# EAGLE design icom_interface (EAGLE 7.3.0)
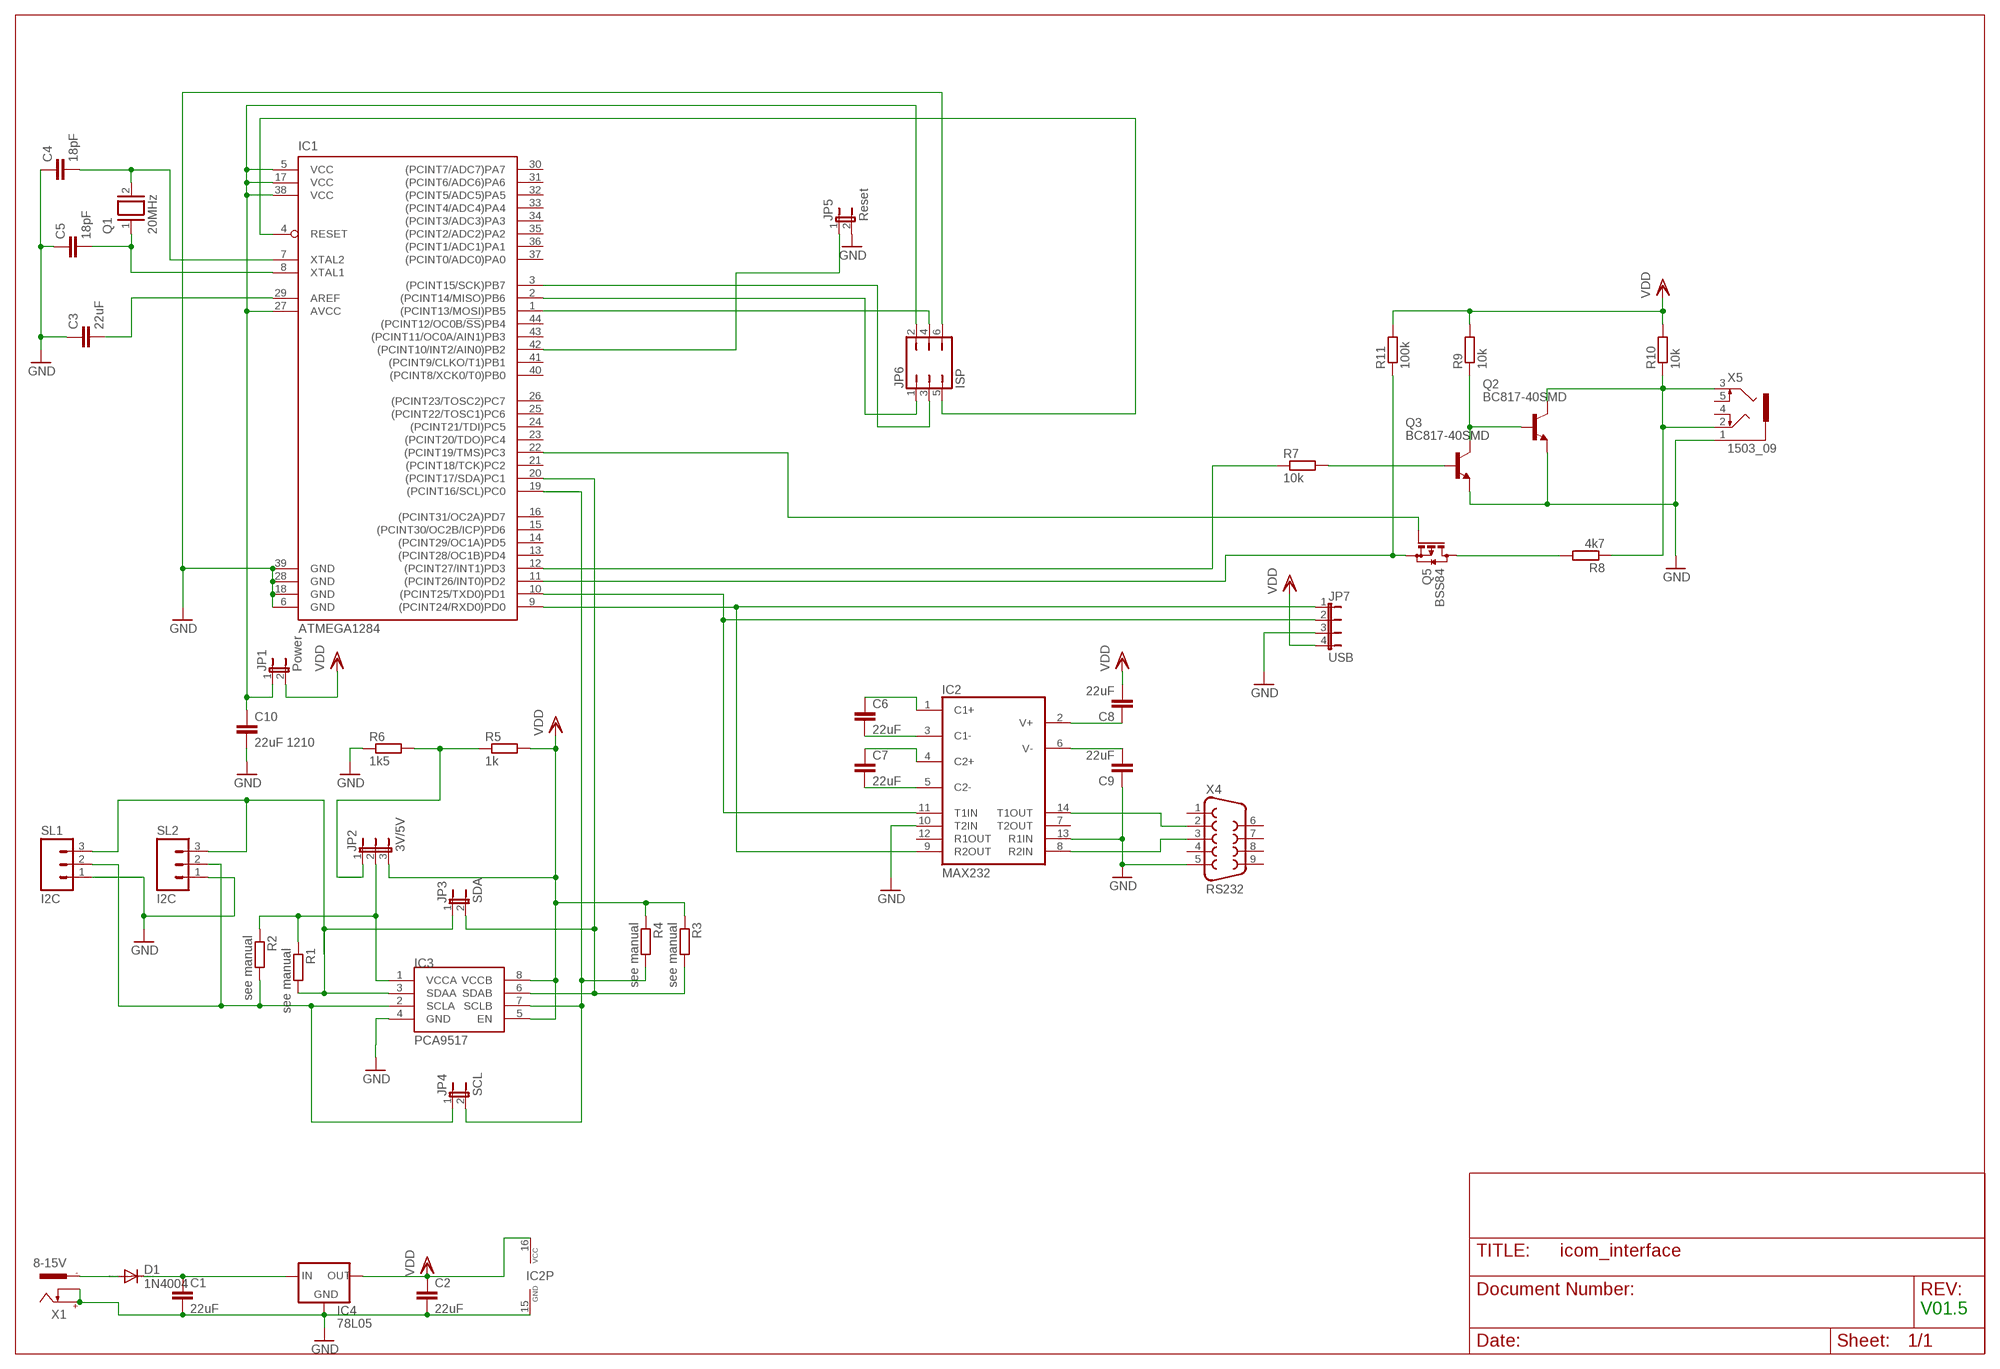
[diagram p0: schematic, sheet 1]

## Parts
C1  22uF  C-EUC1206  [C1206]
C2  22uF  C-EUC1206  [C1206]
C3  22uF  C-EUC1206  [C1206]
C4  18pF  C-EU025-025X050  [C025-025X050]
C5  18pF  C-EU025-025X050  [C025-025X050]
C6  22uF  C-EUC1206  [C1206]
C7  22uF  C-EUC1206  [C1206]
C8  22uF  C-EUC1206  [C1206]
C9  22uF  C-EUC1206  [C1206]
C10  22uF 1210  C-EUC1206  [C1206]
D1  1N4004  [DO41-10]
IC1  ATMEGA1284  ATMEGA644A  [TQFP44]
IC2  MAX232  [DIL16]
IC3  PCA9517  [SO-08]
IC4  78L05  78LXX  [78LXX]
JP1  Power  JP1E  [JP1]
JP2  3V/5V  JP2E  [JP2]
JP3  SDA  JP1E  [JP1]
JP4  SCL  JP1E  [JP1]
JP5  Reset  JP1E  [JP1]
JP6  ISP  JP3Q  [JP3Q]
JP7  USB  JP4E  [JP4]
Q1  20MHz  XTAL/S  [QS]
Q2  BC817-40SMD  [SOT23-BEC]
Q3  BC817-40SMD  [SOT23-BEC]
Q5  BSS84  [SOT23]
R1  see manual  R-EU_R1206  [R1206]
R2  see manual  R-EU_R1206  [R1206]
R3  see manual  R-EU_R1206  [R1206]
R4  see manual  R-EU_R1206  [R1206]
R5  1k  R-EU_R1206  [R1206]
R6  1k5  R-EU_R1206  [R1206]
R7  10k  R-EU_R1206  [R1206]
R8  4k7  R-EU_R1206  [R1206]
R9  10k  R-EU_R1206  [R1206]
R10  10k  R-EU_R1206  [R1206]
R11  100k  R-EU_R1206  [R1206]
SL1  I2C  M03  [03P]
SL2  I2C  M03  [03P]
X1  8-15V  737992-55  [737992-5]
X4  RS232  F09H  [F09H]
X5  1503_09  [1503_09]

## Nets
C13: C6.1 IC2.1(C1+)
GND: C1.2 C2.2 C3.1 C4.1 C5.1 C9.1 C10.2 IC1.6(GND) IC1.18(GND) IC1.28(GND) IC1.39(GND) IC2.10(T2IN) IC2.13(R1IN) IC2.15(GND) IC3.4(GND) IC4.GND JP5.2 JP6.6 JP7.3 Q2.E Q3.E R6.1 SL1.1 SL2.1 X1.+ X1.K X4.5 X5.1
N$1: Q3.B R7.2
N$2: IC1.9((PCINT24/RXD0)PD0) IC2.9(R2OUT) JP7.1
N$3: C7.2 IC2.5(C2-)
N$5: IC1.20((PCINT17/SDA)PC1) IC3.6(SDAB) JP3.2 R3.2
N$6: IC1.2((PCINT14/MISO)PB6) JP6.1
N$7: C10.1 IC1.5(VCC) IC1.17(VCC) IC1.27(AVCC) IC1.38(VCC) JP1.1 JP6.2
N$8: C4.2 IC1.7(XTAL2) Q1.2
N$9: Q2.C R8.1 R10.1 X5.2 X5.3
N$10: IC2.14(T1OUT) X4.2
N$11: IC1.12((PCINT27/INT1)PD3) R7.1
N$12: IC1.10((PCINT25/TXD0)PD1) IC2.11(T1IN) JP7.2
N$13: C7.1 IC2.4(C2+)
N$14: C6.2 IC2.3(C1-)
N$15: IC1.42((PCINT10/INT2/AIN0)PB2) JP5.1
N$16: C8.1 IC2.2(V+)
N$17: C9.2 IC2.6(V-)
N$18: IC1.4(RESET) JP6.5
N$19: IC1.11((PCINT26/INT0)PD2) Q5.2(S) R11.1
N$20: IC1.3((PCINT15/SCK)PB7) JP6.3
N$21: C5.2 IC1.8(XTAL1) Q1.1
N$22: IC1.19((PCINT16/SCL)PC0) IC3.7(SCLB) JP4.2 R4.2
N$23: IC3.3(SDAA) JP3.1 R1.2 SL1.3 SL2.3
N$24: C3.2 IC1.29(AREF)
N$25: IC3.2(SCLA) JP4.1 R2.2 SL1.2 SL2.2
N$26: JP2.1 R5.1 R6.2
N$27: D1.A X1.-1
N$28: IC1.1((PCINT13/MOSI)PB5) JP6.4
N$29: Q5.3(D) R8.2
N$30: Q2.B Q3.C R9.1
N$32: IC3.1(VCCA) JP2.2 R1.1 R2.1
N$33: C1.1 D1.C IC4.IN
N$34: IC1.22((PCINT19/TMS)PC3) Q5.1(G)
N$41: IC2.8(R2IN) X4.3
VDD: C2.1 C8.2 IC2.16(VCC) IC3.5(EN) IC3.8(VCCB) IC4.OUT JP1.2 JP2.3 JP7.4 R3.1 R4.1 R5.2 R9.2 R10.2 R11.2
Unconnected: IC1.13((PCINT28/OC1B)PD4) IC1.14((PCINT29/OC1A)PD5) IC1.15((PCINT30/OC2B/ICP)PD6) IC1.16((PCINT31/OC2A)PD7) IC1.21((PCINT18/TCK)PC2) IC1.23((PCINT20/TDO)PC4) IC1.24((PCINT21/TDI)PC5) IC1.25((PCINT22/TOSC1)PC6) IC1.26((PCINT23/TOSC2)PC7) IC1.30((PCINT7/ADC7)PA7) IC1.31((PCINT6/ADC6)PA6) IC1.32((PCINT5/ADC5)PA5) IC1.33((PCINT4/ADC4)PA4) IC1.34((PCINT3/ADC3)PA3) IC1.35((PCINT2/ADC2)PA2) IC1.36((PCINT1/ADC1)PA1) IC1.37((PCINT0/ADC0)PA0) IC1.40((PCINT8/XCK0/T0)PB0) IC1.41((PCINT9/CLKO/T1)PB1) IC1.43((PCINT11/OC0A/AIN1)PB3) IC1.44((PCINT12/OC0B/!SS!)PB4) IC2.7(T2OUT) IC2.12(R1OUT) X1.-2 X4.1 X4.4 X4.6 X4.7 X4.8 X4.9 X5.4 X5.5

## Notes on the sheet
- V01.5

## Library data of the parts
C1-C3 C6-C10 = rcl:C-EU: CAPACITOR, European symbol
C4 C5 = resistor:C-EU: CAPACITOR, European symbol
D1 = diode:1N4004: DIODE general purpose rectifier, 1 A
IC1 = atmel:ATMEGA644: 8-bit Microcontroller with 64K Bytes In-System Programmable Flash Source: http://www.atmel.com/dyn/resources/prod_documents/doc2593.pdf; MPN: ATMEGA644PV-10AU; OC_FARNELL: 1455123; OC_NEWARK: 58M3748
IC2 = maxim:MAX232: RS232 TRANSCEIVER; MF: MAXIM; MPN: MAX232ACPE+; OC_FARNELL: 9723773; OC_NEWARK: 68K4544
IC3 = PCA9517:PCA9517: PCA9517
IC4 = v-reg:78LXX: VOLTAGE REGULATOR
JP1 JP3-JP5 = jumper:JP1E: JUMPER
JP2 = jumper:JP2E: JUMPER
JP6 = jumper:JP3Q: JUMPER
JP7 = jumper:JP4E: JUMPER
Q1 = special:XTAL/S: CRYSTAL
Q2 Q3 = transistor-npn:BC817*: NPN Transistor
Q5 = transistor-small-signal:BSS84: P-CHANNEL MOS FET
R1-R11 = resistor:R-EU_: RESISTOR, European symbol
SL1 SL2 = con-amp-quick:M03: AMP QUICK CONNECTOR; OC_FARNELL: unknown; OC_NEWARK: unknown
X1 = con-conrad:737992-55: FEMALE PRINT CONNECTOR DIN 45323 (34V/3A), ROKA, distributor Conrad
X4 = con-subd:F09: SUB-D; OC_FARNELL: unknown; OC_NEWARK: unknown
X5 = con-lumberg:1503_09: Jack connectors according to JISC 6560, 3.5 mm Klinkeneinbaukupplung nach JISC 6560, 3,5 mm, 3-polig/ stereo, abgewinkelte Ausführung, mit 2 Öffnern und Lötaugen, für Leiterplatten Rückseitenmontage Source: http://www.lumberg.com/Produkte/PDFs/1503_09.pdf; OC_FARNELL: 1243244; OC_NEWARK: unknown

## Board
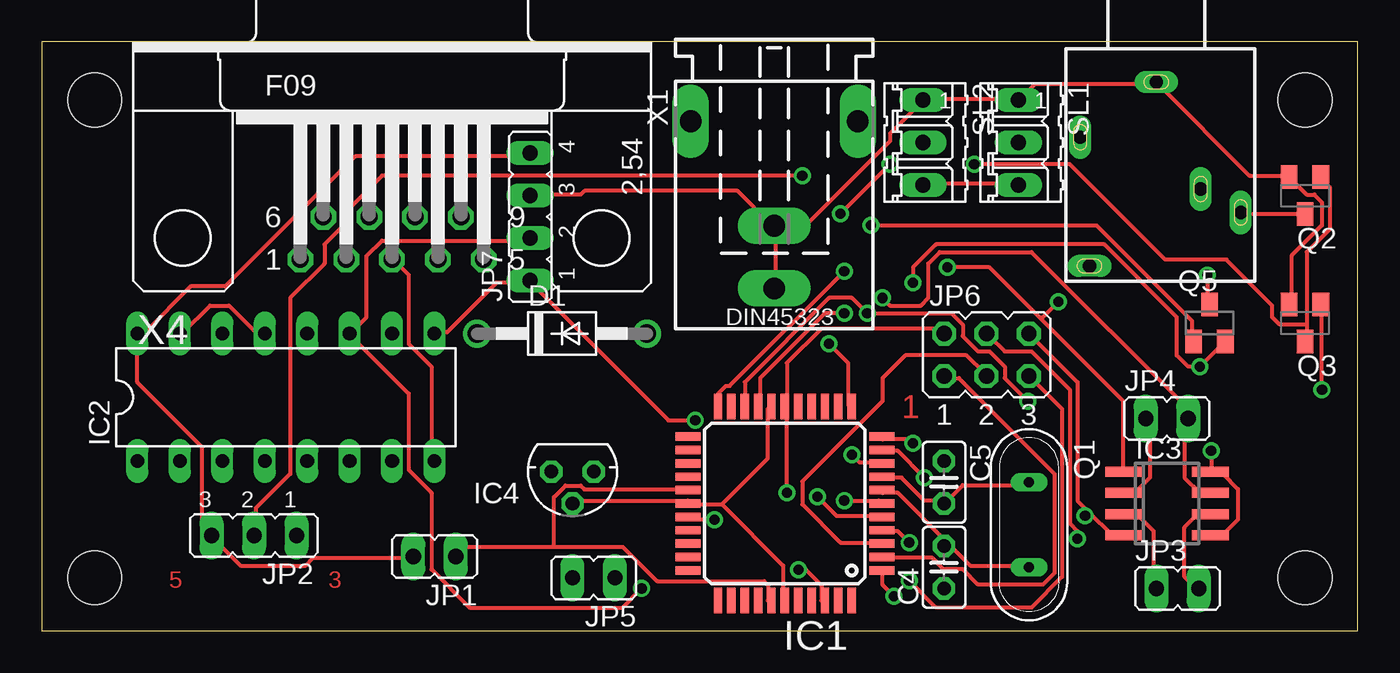
[diagram p1: board, top side]
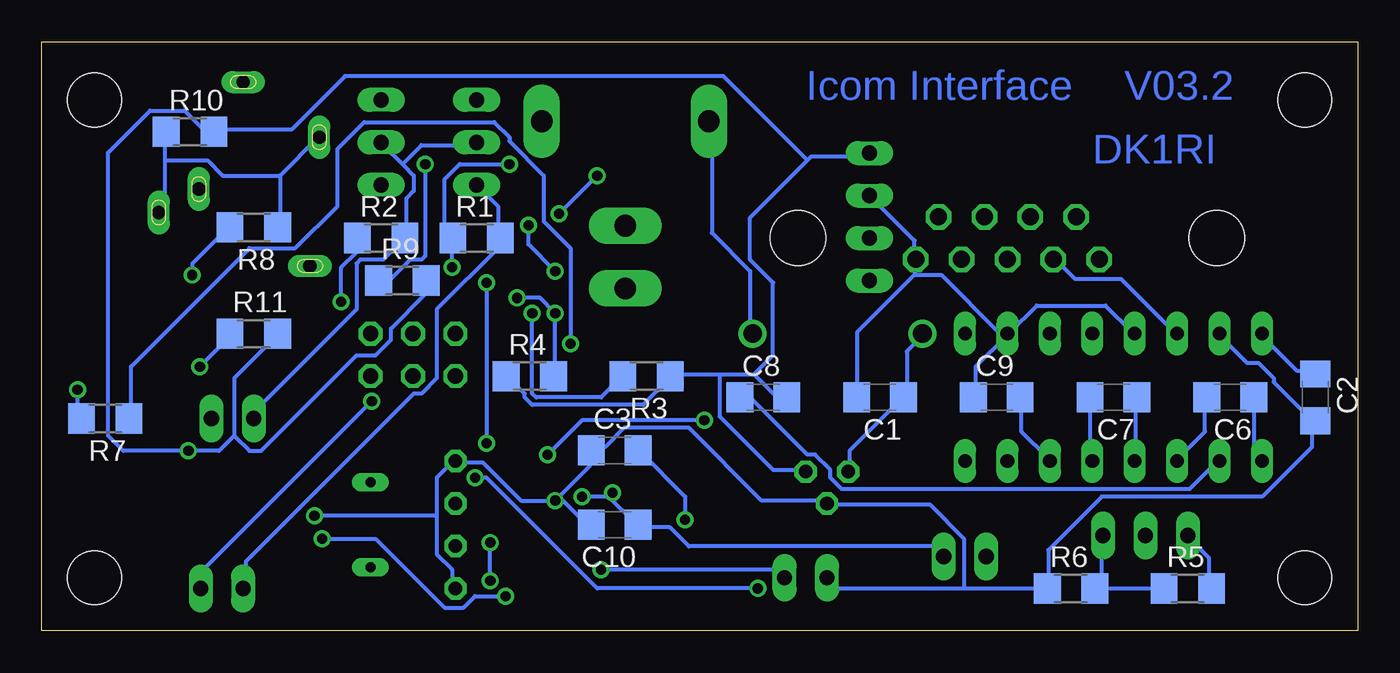
[diagram p2: board, bottom side, seen from below]

Size 78.72 x 35.23 mm. Coordinates in mm from the lower left corner, seen from the top.
Outline: 0,0 78.72,0 78.72,35.23 0,35.23 0,0
Copper layers (1*16): Top 0.035mm / dielectric 1.5mm / Bottom 0.035mm
Design rules "default": minimum track width 10mil, minimum drill 24mil, track to track 8mil, track to pad 8mil, pad to pad 8mil, via to via 8mil, smd to smd 8mil, copper to edge 40mil, drill to drill 8mil, minimum pad ring 10mil, minimum via ring 8mil, stop-mask expansion 4mil, vias tented up to drill 0mil, thermal gap 10mil
Holes 3.2 mm at 75.56,31.75 75.56,3.17 3.17,3.17 3.17,31.75

### Footprints (pad centres in the part's own frame; a part is rotated, then mirrored left to right if it is on the bottom)
C1206 = smd 1.6 x 1.8: 1 -1.4,0; 2 1.4,0
C025-025X050 = drill 0.813 octagon: 1 -1.27,0; 2 1.27,0
DO41-10 = drill 1.118: A 5.08,0; C -5.08,0
TQFP44 = smd 1.5 x 0.5: 1 -5.8,4; 2 -5.8,3.2; 3 -5.8,2.4; 4 -5.8,1.6; 5 -5.8,0.8; 6 -5.8,0; 7 -5.8,-0.8; 8 -5.8,-1.6; 9 -5.8,-2.4; 10 -5.8,-3.2; 11 -5.8,-4; 23 5.8,-4; 24 5.8,-3.2; 25 5.8,-2.4; 26 5.8,-1.6; 27 5.8,-0.8; 28 5.8,0; 29 5.8,0.8; 30 5.8,1.6; 31 5.8,2.4; 32 5.8,3.2; 33 5.8,4 | smd 0.5 x 1.5: 12 -4,-5.8; 13 -3.2,-5.8; 14 -2.4,-5.8; 15 -1.6,-5.8; 16 -0.8,-5.8; 17 0,-5.8; 18 0.8,-5.8; 19 1.6,-5.8; 20 2.4,-5.8; 21 3.2,-5.8; 22 4,-5.8; 34 4,5.8; 35 3.2,5.8; 36 2.4,5.8; 37 1.6,5.8; 38 0.8,5.8; 39 0,5.8; 40 -0.8,5.8; 41 -1.6,5.8; 42 -2.4,5.8; 43 -3.2,5.8; 44 -4,5.8
DIL16 = drill 0.813 long: 1 -8.89,-3.81; 2 -6.35,-3.81; 3 -3.81,-3.81; 4 -1.27,-3.81; 5 1.27,-3.81; 6 3.81,-3.81; 7 6.35,-3.81; 8 8.89,-3.81; 9 8.89,3.81; 10 6.35,3.81; 11 3.81,3.81; 12 1.27,3.81; 13 -1.27,3.81; 14 -3.81,3.81; 15 -6.35,3.81; 16 -8.89,3.81
SO-08 = smd 0.6 x 2.2: 1 -1.905,-2.6; 2 -0.635,-2.6; 3 0.635,-2.6; 4 1.905,-2.6; 5 1.905,2.6; 6 0.635,2.6; 7 -0.635,2.6; 8 -1.905,2.6
78LXX = drill 0.813 octagon: GND 0,1.905; IN 1.27,0; OUT -1.27,0
JP1 = drill 0.914 long: 1 0,-1.27; 2 0,1.27
JP2 = drill 0.914 long: 1 -2.54,0; 2 0,0; 3 2.54,0
JP3Q = drill 0.914 octagon: 1 -2.54,-1.27; 2 -2.54,1.27; 3 0,-1.27; 4 0,1.27; 5 2.54,-1.27; 6 2.54,1.27
JP4 = drill 0.914 long: 1 -3.81,0; 2 -1.27,0; 3 1.27,0; 4 3.81,0
QS = drill 0.61 long: 1 -2.54,0; 2 2.54,0
SOT23-BEC = smd 1 x 1.4: B -0.95,-1.1; C 0,1.1; E 0.95,-1.1
SOT23 = smd 1 x 1.4: 1 -0.95,-1.1; 2 0.95,-1.1; 3 0,1.1
R1206 = smd 1.6 x 1.803: 1 -1.422,0; 2 1.422,0
03P = drill 0.914 long: 1 -2.54,0; 2 0,0; 3 2.54,0
737992-5 = drill 1.3 pad 2.184 long: + 0,10; -1 5,0; -2 -5,0; K 0,6.25
F09H = drill 1.016 octagon: 1 -5.486,-1.27; 2 -2.743,-1.27; 3 0,-1.27; 4 2.743,-1.27; 5 5.486,-1.27; 6 -4.115,1.27; 7 -1.372,1.27; 8 1.372,1.27; 9 4.115,1.27 | hole 3.302: -12.522,0; 12.522,0
1503_09 = drill 0.8 pad 1.2 long: 1 0,-2.1; 2 -4.55,-5.4; 3 5.05,-9.9; 4 -4,-13.1; 5 2.65,-8.5

### Placement (x,y rotation side)
C1  28.57,13.97 180 bottom
C2  2.54,13.97 270 bottom
C3  44.45,10.79 0 bottom
C4  53.98,3.81 90 top
C5  53.98,8.89 270 top
C6  7.62,13.97 180 bottom
C7  14.61,13.97 180 bottom
C8  35.56,13.97 0 bottom
C9  21.59,13.97 0 bottom
C10  44.45,6.35 180 bottom
D1  31.11,17.78 0 top
IC1  44.45,7.62 180 top
IC2  14.61,13.97 0 top
IC3  67.31,7.62 270 top
IC4  31.75,9.53 180 top
JP1  23.5,4.45 90 top
JP2  12.7,5.71 180 top
JP3  67.94,2.54 270 top
JP4  67.31,12.7 270 top
JP5  33.02,3.17 90 top
JP6  56.52,16.51 0 top
JP7  29.21,24.77 90 top
Q1  59.05,6.35 270 top
Q2  75.56,26.04 180 top
Q3  75.56,18.41 180 top
Q5  69.85,18.41 0 top
R1  52.7,23.5 0 bottom
R2  58.42,23.5 0 bottom
R3  42.55,15.24 180 bottom
R4  49.53,15.24 0 bottom
R5  10.16,2.54 0 bottom
R6  17.14,2.54 0 bottom
R7  74.93,12.7 180 bottom
R8  66.04,24.13 180 bottom
R9  57.15,20.95 0 bottom
R10  69.85,29.84 0 bottom
R11  66.04,17.78 0 bottom
SL1  58.42,29.21 270 top
SL2  52.7,29.21 270 top
X1  43.81,30.48 180 top
X4  20.95,23.5 0 top
X5  66.67,34.92 0 top

### Tracks (layer width: path | path; a pad name or v marks a point on that pad's centre or on a via)
C13
  Bottom 0.254: C6.1 6.17,13.97 6.17,10.77 5.71,10.31 IC2.1
GND  (via drill 0.61)
  Top 0.254: 62.64,7.11 61.95,7.8 61.95,14.88 JP6.6 | 62.64,7.11 64.01,5.74 64.69,5.74 IC3.4 | v48.01,7.8 50.06,7.8 IC1.6 | IC4.GND 31.77,7.8 38.63,7.8 IC1.28 38.86,7.57 40.69,7.57 | 40.69,7.57 44.35,3.91 44.35,1.85 IC1.39 | 40.69,7.57 43.43,10.31 43.43,13.28 IC1.18 | v62.41,6.88 62.64,7.11 | IC2.13 13.26,17.86 12.8,17.86 11.2,19.46 10.06,19.46 8.46,17.86 IC2.15 | X1.+ 43.89,20.6 43.89,24.03 X1.K | Q3.E 74.75,19.68 74.75,22.43 76.58,24.26 76.58,25.63 76.12,26.09 75.67,26.09 74.75,27 Q2.E 74.52,27.23 72.24,27.23 66.75,32.72 X5.1 66.52,32.72 59.44,32.72 58.52,31.8 SL1.1 58.29,31.8 52.81,31.8 SL2.1 52.58,31.57 50.75,29.74 50.75,29.29 45.72,24.26 43.89,24.26 X1.K | JP7.3 29.26,26.09 32.23,26.09 32.46,26.31 41.6,26.31 43.66,24.26 X1.K
  Bottom 0.254: v48.01,7.8 47.55,7.8 45.95,6.2 C10.2 | v48.01,7.8 45.95,9.86 45.95,10.77 C3.1 45.72,11 45.03,11 43.89,12.14 40.01,12.14 35.66,7.8 31.77,7.8 IC4.GND 31.55,7.57 25.6,7.57 23.55,5.51 23.55,2.54 | 55.09,6.88 55.09,9.17 54.18,10.08 C5.1 53.95,10.08 52.35,10.08 50.06,7.8 v48.01,7.8 | 55.09,6.88 55.09,4.6 54.18,3.68 54.18,2.54 C4.1 | 23.55,2.54 31.09,2.54 31.55,3 JP5.2 | 23.55,2.54 R6.1 18.52,2.54 18.52,4.83 15.32,8.03 5.71,8.03 2.74,11 2.74,12.37 C2.2 2.74,12.6 5.03,14.88 5.03,15.11 5.94,16.03 6.63,16.03 8.23,17.63 IC2.15 | 55.09,6.88 v62.41,6.88 | C9.1 22.86,13.97 22.86,15.8 21.03,17.63 IC2.10 | 26.52,21.29 29.95,17.86 29.95,13.97 C1.2 | 26.52,21.29 26.52,22.2 X4.5 26.52,22.43 26.52,23.34 JP7.3 | 26.52,21.29 24.92,21.29 21.49,17.86 21.03,17.86 IC2.10 | IC2.13 13.49,17.86 15.09,19.46 19.2,19.46 20.8,17.86 IC2.10
N$1  (via drill 0.61)
  Top 0.254: v76.58,14.43 76.58,19.46 Q3.B
  Bottom 0.254: v76.58,14.43 76.58,13.06 76.35,12.83 R7.2
N$2  (via drill 0.61)
  Top 0.254: v48.46,10.54 48.92,10.08 50.06,10.08 IC1.9 | v39.09,12.6 37.49,12.6 29.26,20.83 JP7.1 29.03,20.83 27.2,20.83 24.23,17.86 23.55,17.86 IC2.9
  Bottom 0.254: v48.46,10.54 46.41,12.6 v39.09,12.6
N$3
  Bottom 0.254: C7.2 16,10.31 IC2.5
N$5  (via drill 0.61)
  Top 0.254: IC3.6 69.72,6.88 69.04,6.88 68.35,6.2 68.35,3.23 69.04,2.54 JP3.2 | IC1.20 42.06,13.51 42.06,14.88 47.09,19.91 48.46,19.91 v49.38,19 54.41,19 55.09,18.31 55.09,17.63 56.01,16.71 56.69,16.71 57.61,15.8 57.61,15.11 v58.98,13.74
  Bottom 0.254: v49.38,19 49.38,14.2 49.15,13.97 45.26,13.97 44.12,15.11 R3.2 | v58.98,13.74 69.04,3.68 69.04,2.54 JP3.2
N$6
  Top 0.254: IC1.2 50.29,4.37 53.26,4.37 53.95,3.68 55.09,3.68 56.01,2.77 59.89,2.77 60.58,3.45 60.58,9.4 54.86,15.11 54.18,15.11 JP6.1
N$7  (via drill 0.61)
  Top 0.254: JP6.2 53.95,17.86 53.72,18.09 46.63,18.09 44.58,16.03 44.58,13.51 IC1.17 44.58,13.28 v44.58,8.26 | v46.41,8.03 47.55,6.88 50.06,6.88 IC1.5 | 30.63,5.03 25.38,5.03 24.92,4.57 JP1.1 | 30.63,5.03 34.75,5.03 36.8,2.97 43.2,2.97 43.43,2.74 43.43,1.83 IC1.38 | 30.63,5.03 30.63,8 31.32,8.69 32.23,8.69 32.46,8.46 38.63,8.46 IC1.27
  Bottom 0.254: 44.81,8.03 v46.41,8.03 | 44.81,8.03 43.2,6.43 C10.1 42.98,6.2 41.15,6.2 40.01,5.05 25.38,5.05 JP1.1 | 44.81,8.03 v44.58,8.26
N$8
  Top 0.254: 54.18,5.28 51.21,8.26 50.29,8.26 IC1.7 | 54.18,5.28 55.55,3.91 58.98,3.91 Q1.2 | 54.18,5.28 C4.2
N$9
  Top 0.254: Q2.C 75.44,24.94 71.78,24.94 X5.3
  Bottom 0.254: 64.47,27.23 64.47,24.26 R8.1 | 64.47,27.23 62.18,29.52 X5.2 | 71.32,28.14 71.32,25.4 71.55,25.17 X5.3 | 71.32,28.14 71.32,29.74 R10.1 | 64.47,27.23 67.89,27.23 68.81,28.14 71.32,28.14
N$10
  Bottom 0.254: IC2.14 10.97,17.86 14.17,21.06 16.92,21.06 18.06,22.2 X4.2
N$11  (via drill 0.61)
  Top 0.254: v47.09,17.17 48.23,16.03 48.23,13.51 IC1.12
  Bottom 0.254: v47.09,17.17 47.09,22.89 48.69,24.49 48.69,27.23 50.75,29.29 50.75,29.52 51.66,30.43 59.44,30.43 61.04,28.83 61.04,25.4 63.55,22.89 66.29,22.89 73.38,15.8 73.38,12.83 R7.1
N$12  (via drill 0.61)
  Top 0.254: v52.81,9.17 51.21,10.77 50.29,10.77 IC1.10 | v35.89,2.54 34.75,1.4 25.6,1.4 23.32,3.68 23.32,8.26 21.95,9.63 21.95,14.2 18.52,17.63 IC2.11 18.52,17.86 19.43,18.77 19.43,22.43 20.34,23.34 29.03,23.34 JP7.2
  Bottom 0.254: v52.81,9.17 52.12,9.17 45.49,2.54 v35.89,2.54
N$13
  Bottom 0.254: C7.1 13.26,13.97 13.26,10.31 IC2.4
N$14
  Bottom 0.254: C6.2 9.14,13.97 9.14,11.91 10.74,10.31 IC2.3
N$15  (via drill 0.61)
  Top 0.254: v45.26,3.66 45.72,3.66 46.63,2.74 46.63,1.83 IC1.42
  Bottom 0.254: v45.26,3.66 34.75,3.66 34.29,3.2 JP5.1
N$16
  Bottom 0.254: C8.1 36.35,13.97 32.92,10.54 32.46,10.54 31.55,9.63 31.55,9.17 30.86,8.48 10.06,8.48 8.46,10.08 IC2.2
N$17
  Bottom 0.254: C9.2 20.12,13.97 20.12,11.91 18.52,10.31 IC2.6
N$18  (via drill 0.61)
  Top 0.254: v51.89,5.28 51.21,5.97 50.29,5.97 IC1.4 | v51.89,3 53.49,1.4 59.21,1.4 61.04,3.23 61.04,13.28 59.21,15.11 JP6.5
  Bottom 0.254: v51.89,3 v51.89,5.28
N$19  (via drill 0.61)
  Top 0.254: Q5.2 70.64,17.17 v69.27,15.8 68.58,15.8 67.89,16.48 67.89,18.77 63.55,23.11 53.49,23.11 52.12,21.74 v52.12,20.83 | v52.12,11.23 51.89,11.46 50.29,11.46 IC1.11
  Bottom 0.254: v69.27,15.8 67.44,17.63 R11.1 | v52.12,20.83 v52.12,11.23
N$20
  Top 0.254: IC1.3 50.06,5.28 47.78,5.28 45.49,7.57 45.49,8.94 50.29,13.74 50.29,15.11 51.66,16.48 55.32,16.48 56.46,15.34 JP6.3
N$21
  Top 0.254: IC1.8 50.29,9.17 51.44,9.17 52.81,7.8 53.95,7.8 C5.2 54.18,7.8 55.09,8.71 58.98,8.71 Q1.1
N$22  (via drill 0.61)
  Top 0.254: IC3.7 69.27,8.26 68.35,9.17 68.35,12.37 68.58,12.6 JP4.2 68.58,13.28 59.21,22.66 53.72,22.66 53.03,21.97 53.03,19.91 52.58,19.46 50.75,19.46 v50.29,19.91 | v48.01,19 46.86,19 42.98,15.11 42.98,13.51 IC1.19
  Bottom 0.254: R4.2 48.01,15.34 v48.01,19 48.92,19.91 v50.29,19.91
N$23
  Top 0.254: IC3.3 64.92,6.88 65.61,6.88 66.52,5.97 66.52,2.54 JP3.1 | SL1.3 58.29,26.77 52.81,26.77 SL2.3
  Bottom 0.254: SL2.3 51.44,25.4 51.44,23.57 R1.2 51.44,23.34 51.44,22.89 55.09,19.23 55.09,15.11 56.01,14.2 56.46,14.2 66.52,4.14 66.52,2.54 JP3.1
N$24  (via drill 0.61)
  Top 0.254: v40.23,6.66 38.86,6.66 IC1.29
  Bottom 0.254: v40.23,6.66 40.23,8.03 42.98,10.77 C3.2
N$25
  Top 0.254: IC3.2 65.38,8.26 66.29,9.17 66.29,12.37 66.06,12.6 JP4.1
  Bottom 0.254: 57.15,27.91 58.29,29.06 SL1.2 | 57.15,27.91 56.46,27.23 56.46,26.31 56.92,25.86 56.92,23.57 R2.2 57.15,23.34 58.29,22.2 59.66,22.2 59.89,21.97 59.89,19.23 65.84,13.28 65.84,12.83 JP4.1 | 57.15,27.91 56.01,29.06 52.81,29.06 SL2.2
N$26
  Bottom 0.254: 15.32,2.54 R6.2 15.54,2.54 | 15.32,2.54 R5.1 | 15.32,2.54 15.32,5.51 JP2.1
N$27
  Bottom 0.254: D1.A 36.35,17.86 36.35,21.51 38.63,23.8 38.63,30.43 X1.-1
N$28  (via drill 0.61)
  Top 0.254: v50.98,2.08 50.29,2.77 50.29,3.45 IC1.1 | v61.95,5.51 61.95,5.97 61.49,6.43 61.49,14.43 59.21,16.71 57.61,16.71 56.69,17.63 JP6.4
  Bottom 0.254: v50.98,2.08 52.81,2.08 53.49,1.4 54.63,1.4 58.75,5.51 v61.95,5.51
N$29  (via drill 0.61)
  Top 0.254: v69.72,21.29 69.72,19.68 Q5.3
  Bottom 0.254: v69.72,21.29 69.72,21.97 67.67,24.03 R8.2
N$30  (via drill 0.61)
  Top 0.254: 75.67,18.31 75.67,22.66 77.04,24.03 77.04,26.54 76.58,27 Q2.B | 75.67,18.31 75.67,17.4 Q3.C | v55.78,27.91 61.49,27.91 67.21,22.2 70.87,22.2 73.61,19.46 73.61,18.77 74.07,18.31 75.67,18.31
  Bottom 0.254: v55.78,27.91 55.78,22.43 56.01,22.2 56.69,22.2 57.84,21.06 58.52,21.06 R9.1
N$32  (via drill 0.61)
  Top 0.254: v54.18,21.74 56.69,21.74 59.66,18.77 | 59.66,18.77 64.69,13.74 64.69,9.63 IC3.1 | v60.81,19.68 59.89,18.77 59.66,18.77 | v45.49,27.23 20.34,27.23 18.29,25.17 18.29,24.49 16.92,23.11 16.92,21.97 14.86,19.91 14.86,9.4 12.8,7.34 12.8,5.74 JP2.2 | v50.75,27.91 v47.78,24.94
  Bottom 0.254: v54.18,21.74 54.18,23.34 R1.1 54.18,23.57 54.63,24.03 54.63,27 53.72,27.91 v50.75,27.91 | v60.81,19.68 60.81,21.74 59.89,22.66 59.89,23.34 R2.1 | v47.78,24.94 v45.49,27.23
N$33
  Bottom 0.254: D1.C 26.06,17.63 26.98,16.71 26.98,13.97 C1.1 27.2,13.97 30.4,10.77 30.4,9.63 IC4.IN
N$34  (via drill 0.61)
  Top 0.254: v49.61,24.26 63.09,24.26 68.81,18.54 68.81,17.4 Q5.1 | v48.01,21.51 41.15,14.66 40.92,14.66 40.46,14.2 40.46,13.51 IC1.22
  Bottom 0.254: v49.61,24.26 49.61,23.11 v48.01,21.51
N$41
  Top 0.254: IC2.8 23.32,10.31 23.32,15.8 21.95,17.17 21.95,21.29 21.03,22.2 X4.3
VDD  (via drill 0.61)
  Top 0.254: IC3.5 69.95,5.74 70.64,5.74 71.55,6.66 71.55,8.48 70.64,9.4 69.95,9.4 IC3.8 69.95,9.63 v69.95,10.77 | JP1.2 22.17,4.37 16.23,4.37 15.77,3.91 11.89,3.91 10.29,5.51 JP2.3 10.06,5.74 9.6,6.2 9.6,11 5.71,14.88 IC2.16 5.71,17.86 6.17,17.86 8.91,20.6 10.97,20.6 18.75,28.37 29.03,28.37 JP7.4
  Bottom 0.254: 67.21,11.68 66.29,10.77 65.61,10.77 59.89,16.48 58.75,16.48 57.84,17.4 57.84,18.09 55.78,20.14 55.78,20.83 R9.2 | 67.21,11.68 67.21,15.11 64.69,17.63 R11.2 | 67.21,11.68 68.12,10.77 v69.95,10.77 73.84,10.77 74.75,11.68 74.75,28.6 72.24,31.11 70.18,31.11 69.04,29.97 68.58,29.97 R10.2 68.35,29.97 63.78,29.97 60.58,33.17 37.95,33.17 32.92,28.14 | C2.1 2.74,15.57 3.66,15.57 5.71,17.63 IC2.16 | R5.2 8.91,2.54 8.91,4.37 10.06,5.51 JP2.3 | C8.2 34.75,13.97 36.12,15.34 | 38.18,15.34 40.92,15.34 R3.1 41.15,15.11 42.75,13.51 49.38,13.51 49.84,13.97 49.84,14.2 50.75,15.11 R4.1 | 38.18,15.34 36.12,15.34 | 38.18,15.34 38.18,12.83 34.98,9.63 33.15,9.63 IC4.OUT | 32.92,28.14 36.35,24.71 36.35,22.2 34.98,20.83 34.98,16.48 36.12,15.34 | 32.92,28.14 32.69,28.37 29.26,28.37 JP7.4

### Text on the board
Top: 1 | 5 | 3
Bottom: V03.2 | Icom Interface | DK1RI